# Altium schematic sheet debug-board.SchDoc
size A4; SheetNumber: 2; SheetTotal: 2
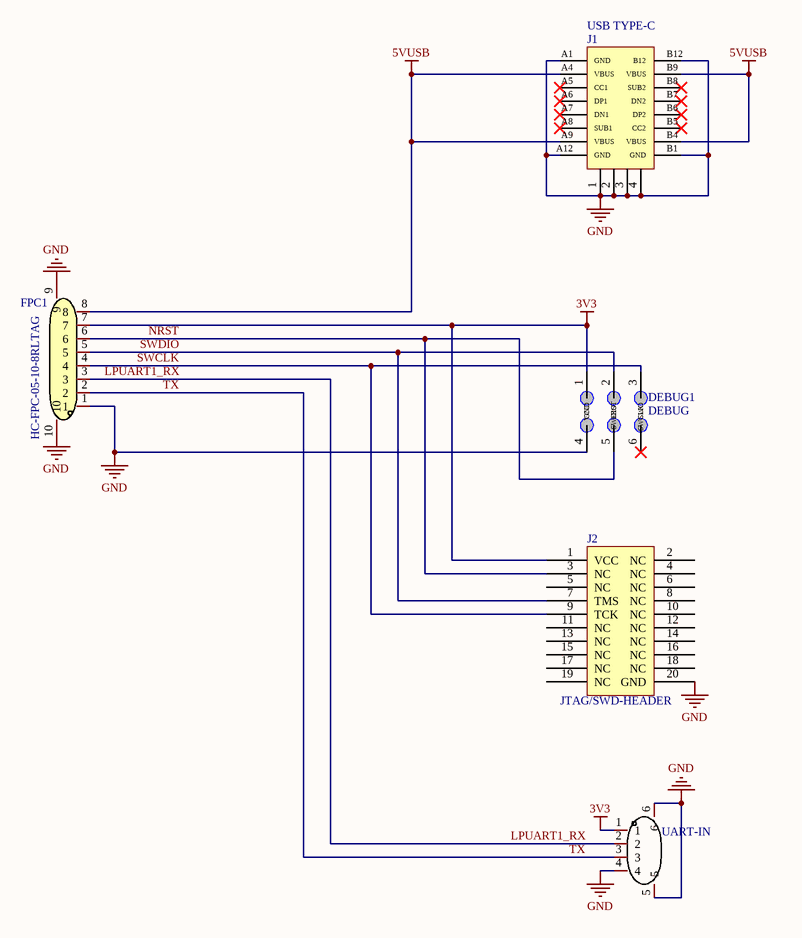
[diagram p0: debug-board.SchDoc]

## Parts
CN1  UART-IN  [CONN-SMD_4P-P1.00_WF10004-01200]
DEBUG1  DEBUG  [DEBUG-2x3P-1.27mm Pitch]
FPC1  HC-FPC-05-10-8RLTAG  [FPC-SMD_8P-P0.50_HCTL_HC-FPC-05-10-8RLTAG]
J1  USB TYPE-C  [TYPE-C-16P]
J2  JTAG/SWD-HEADER  [JATG/SWD]

## Nets
3V3: CN1.1 DEBUG1.1(VCC) FPC1.7 J2.1(VCC)
5VUSB: FPC1.8 J1.A4(VBUS) J1.A9(VBUS) J1.B4(VBUS) J1.B9(VBUS)
GND: CN1.4 CN1.5 CN1.6 DEBUG1.4(GND) FPC1.1 FPC1.9 FPC1.10 J1.1 J1.2 J1.3 J1.4 J1.A1(GND) J1.A12(GND) J1.B1(GND) J1.B12 J2.20(GND)
LPUART1_RX: CN1.2 FPC1.3
NRST: DEBUG1.5(nRST) FPC1.6 J2.3(NC)
SWCLK: DEBUG1.3(SWCLK) FPC1.4 J2.9(TCK)
SWDIO: DEBUG1.2(SWDIO) FPC1.5 J2.7(TMS)
TX: CN1.3 FPC1.2

Not connected (* = marked no-connect by the designer): DEBUG1 6(SWO)*; J1 A5(CC1)* A6(DP1)* A7(DN1)* A8(SUB1)* B5(CC2)* B6(DP2)* B7(DN2)* B8(SUB2)*; J2 2(NC) 4(NC) 5(NC) 6(NC) 8(NC) 10(NC) 11(NC) 12(NC) 13(NC) 14(NC) 15(NC) 16(NC) 17(NC) 18(NC) 19(NC)

## Library data of the parts
CN1 = SH1.0-4P: 连接器; Manufacturer: ATOM(爱特姆); Name: WF10004-01200; Add into BOM: yes; Pitch: 1mm; Pins Structure: 1x4P; Number of PINs Per Row: 4; Gender: 公型插针; Current Rating (Max): 500mA; Symbol: WF10004-01200; Device: WF10004-01200; LCSC Part Name: 1mm 1x4P 卧贴; Supplier Part: C479990; Manufacturer Part: WF10004-01200; Supplier Footprint: SMD,P=1mm; JLCPCB Part Class: Extended Part; Datasheet: https://atta.szlcsc.com/upload/public/pdf/source/20200107/C479990_7EE1728C707014A64676B41D860FB4D7.pdf; Supplier: LCSC; Convert to PCB: yes; Reference Series: -; Number of Rows: 1; Row Spacing: -; Mounting Style: 卧贴; Operating Temperature Range: -25℃~+85℃
DEBUG1 = DEBUG-PogoPin-2x6P: 弹簧探针烧录/调试触点
FPC1 = HC-FPC-05-10-8RLTAG: FPC连接器 0.5mm pitch 8p; Manufacturer: HCTL(华灿天禄); Add into BOM: yes; Locking Feature: 翻盖式; FFC, FCB Thickness: 0.3mm; Symbol: HC-FPC-05-10-8RLTAG; Device: HC-FPC-05-10-8RLTAG; LCSC Part Name: 翻盖式 下接 P数:8P 间距:0.5mm; Supplier Part: C5213730; Manufacturer Part: HC-FPC-05-10-8RLTAG; Supplier Footprint: SMD,P=0.5mm,卧贴; JLCPCB Part Class: 扩展库; Datasheet: https://atta.szlcsc.com/upload/public/pdf/source/20221027/B2DE489DA152049D1F105170189CFB4E.pdf; Supplier: LCSC; Convert to PCB: yes; Contact Type: 下接; Number of Contacts: 8P; Pitch: 0.5mm; Mounting Type: 卧贴; Height Above Board: 1mm; Contact Material: 铜合金; Operating Temperature Range: -55℃~+85℃; Name: HC-FPC-05-10-8RLTAG
J1 = USB TYPE-C: USB TYPE-C 母座
J2 = JTAG/SWD-HEADER: 调试接口